# EAGLE design +X SOLAR PANEL (EAGLE 8.7.0)
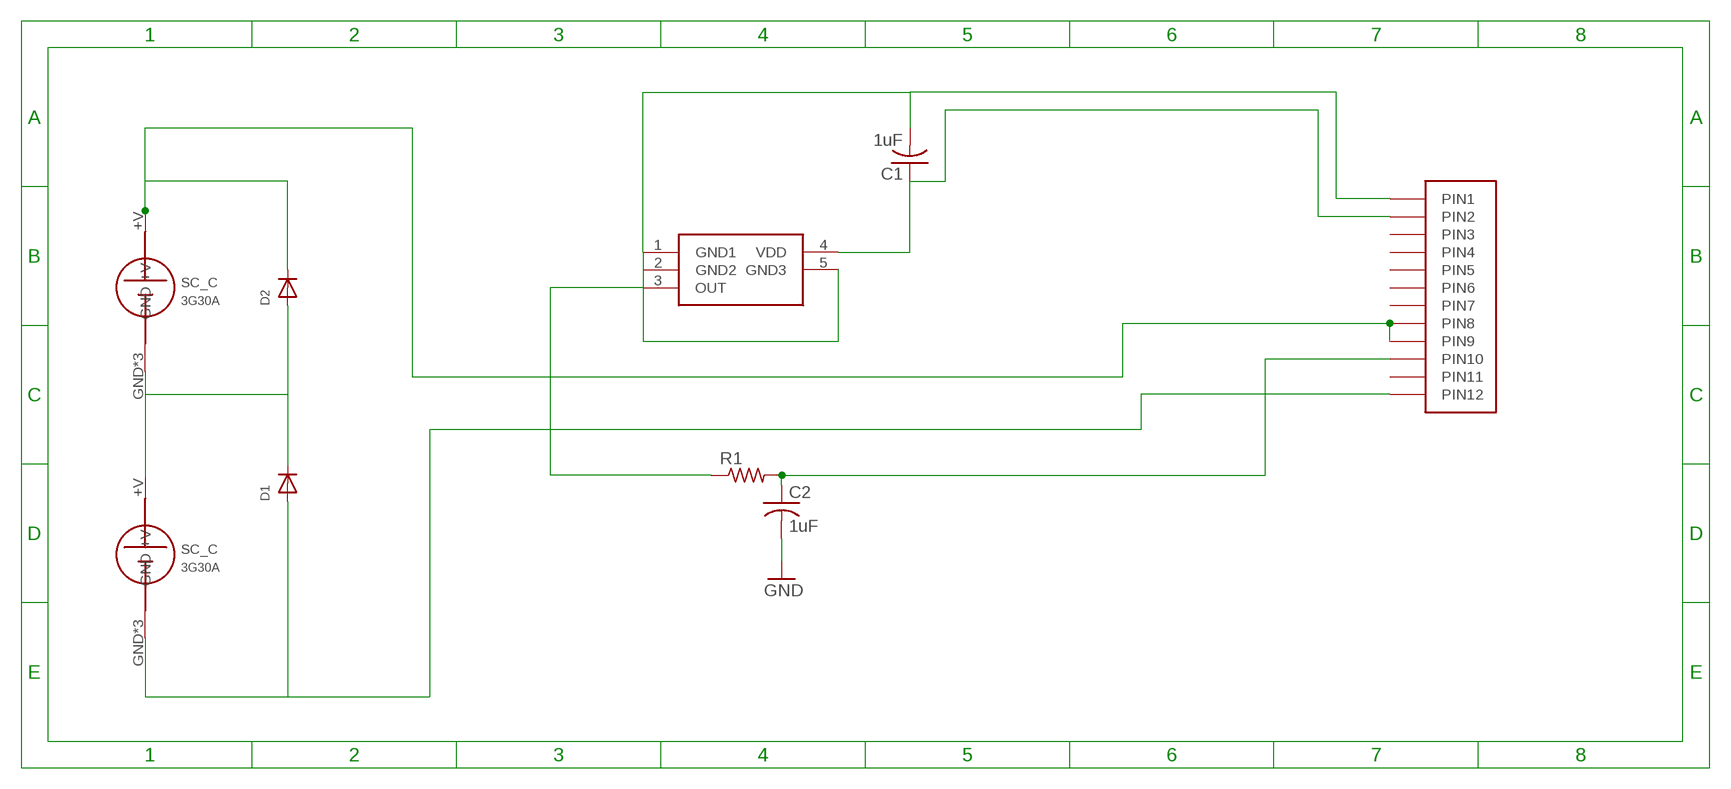
[diagram p0: schematic, sheet 1]

## Parts
C1  1uF  C-USC0805  [C0805]
C2  1uF  C-USC0805  [C0805]
D1  DIODE_SOD-123FL  [SOD-123FL]
D2  DIODE_SOD-123FL  [SOD-123FL]
R1  R-US_R0402  [R0402]
U$1  HEADER12PIN  [HEADER12PIN]
U$3  LMT84DCKT  [SOT65P210X110-5N]
U$4  SC_C  [SC_C]
U$5  SC_C  [SC_C]

## Nets
+V: D2.C U$1.P8(PIN8) U$1.P9(PIN9) U$4.+V
GND: C1.2 C2.2 D1.A U$1.P1(PIN1) U$1.P12(PIN12) U$3.1(GND1) U$3.2(GND2) U$3.5(GND3) U$5.GND U$5.GND1(GND) U$5.GND2(GND)
N$1: D1.C D2.A U$4.GND U$4.GND1(GND) U$4.GND2(GND) U$5.+V
N$2: R1.1 U$3.3(OUT)
N$3: C2.1 R1.2 U$1.P10(PIN10)
N$10: C1.1 U$1.P2(PIN2) U$3.4(VDD)
Unconnected: U$1.P3(PIN3) U$1.P4(PIN4) U$1.P5(PIN5) U$1.P6(PIN6) U$1.P7(PIN7) U$1.P11(PIN11)

## Library data of the parts
C1 C2 = adafruit:C-US: CAPACITOR, American symbol
D1 D2 = adafruit:DIODE: Diode SMADIODE - SMA Surface Mount Package 20V 1A Schottky Diode Digikey: 641-1014-6-ND DO-1N4148 - Through Hole Small Current Diode SOD-123 20V 1 A (.5mV Vf) Schottky Diode - Digikey: MBRX120TPMSCT-ND SOD-323 10V 570mA (.38mV Vf, 3ns) Schottky Diode - Digikey: ZLLS410CT-ND SOD-523 30V 30mA Schottky Diode (RB751S-40TE61) - Digikey: RB751S-40TE61CT-ND SOT23-R/W - SOT23 Package (R = Solder Paste/Reflow Ovens, W = Hand-Soldering) BAT54Film 40V 300mA - Digikey: 497-7162-1-ND
R1 = adafruit:R-US_: RESISTOR, American symbol
U$1 = BIRDS:HEADER12PIN
U$3 = LMT84DCKT:LMT84DCKT: 1.5V-Capable, 10 uA Analog Output Temperature Sensor in SC70 and TO-92 Source: Datasheet <http://uk.rs-online.com/web/p/products/8115860>; DESCRIPTION: 1.5V-Capable, 10 uA Analog Output Temperature Sensor in SC70 and TO-92; HEIGHT: 1.1mm; MANUFACTURER_NAME: Texas Instruments; MANUFACTURER_PART_NUMBER: LMT84DCKT; RS_PART_NUMBER: 8115860
U$4 U$5 = SC_C:SC_C

## Board
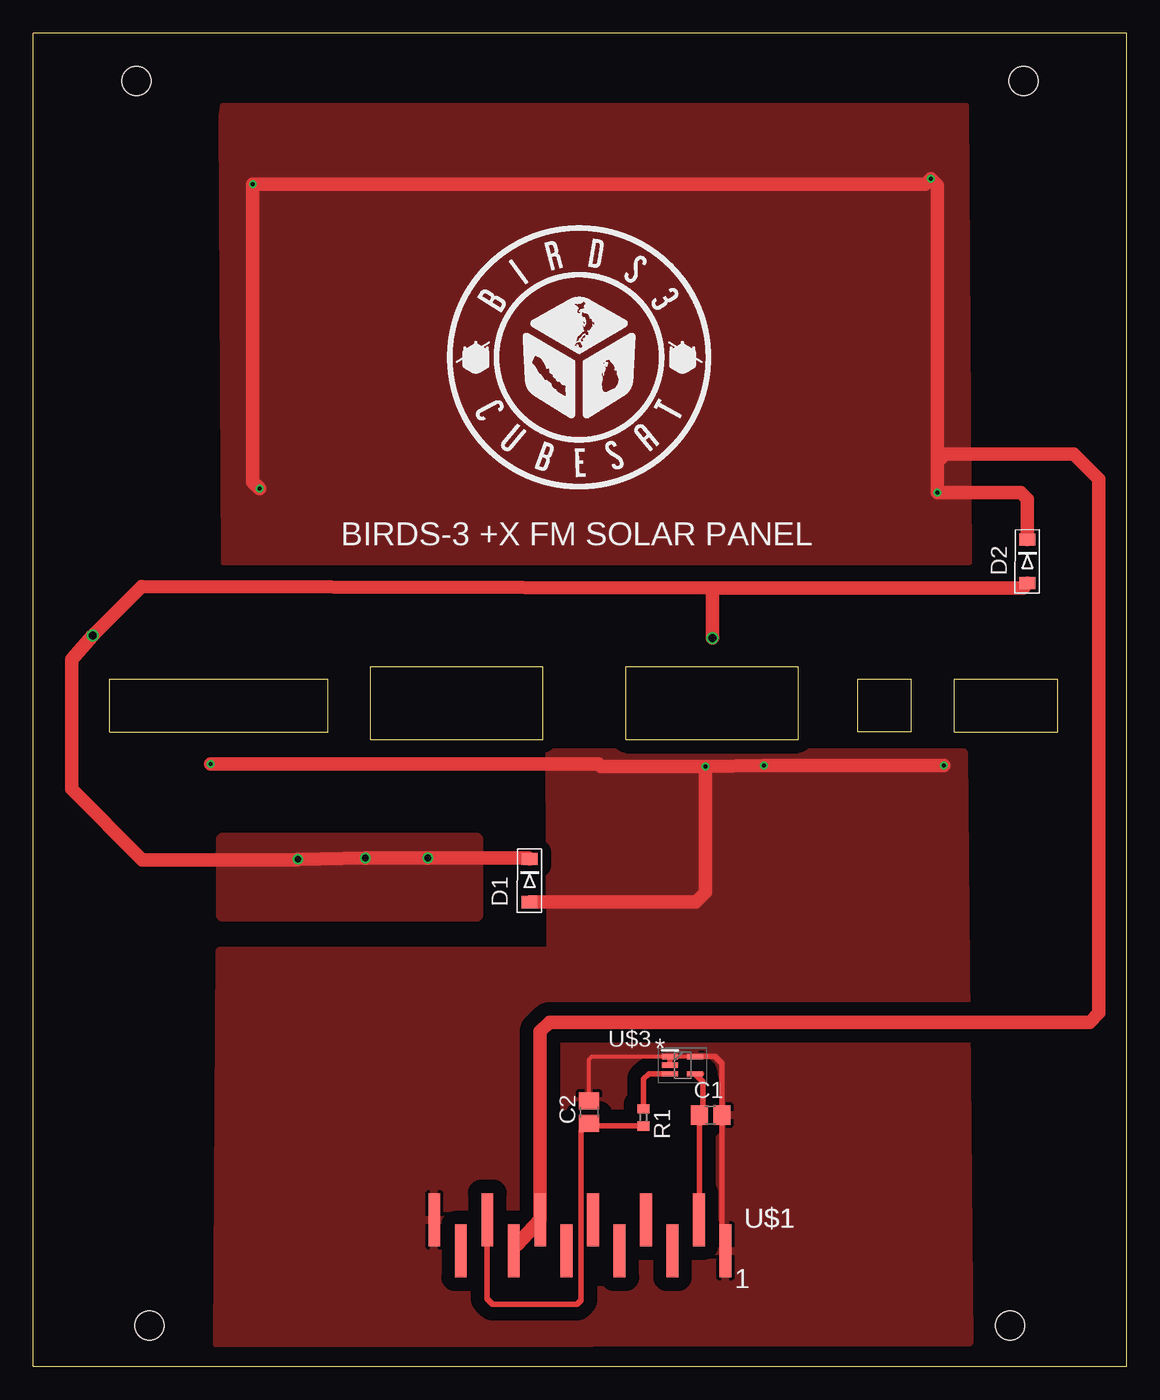
[diagram p1: board, top side]
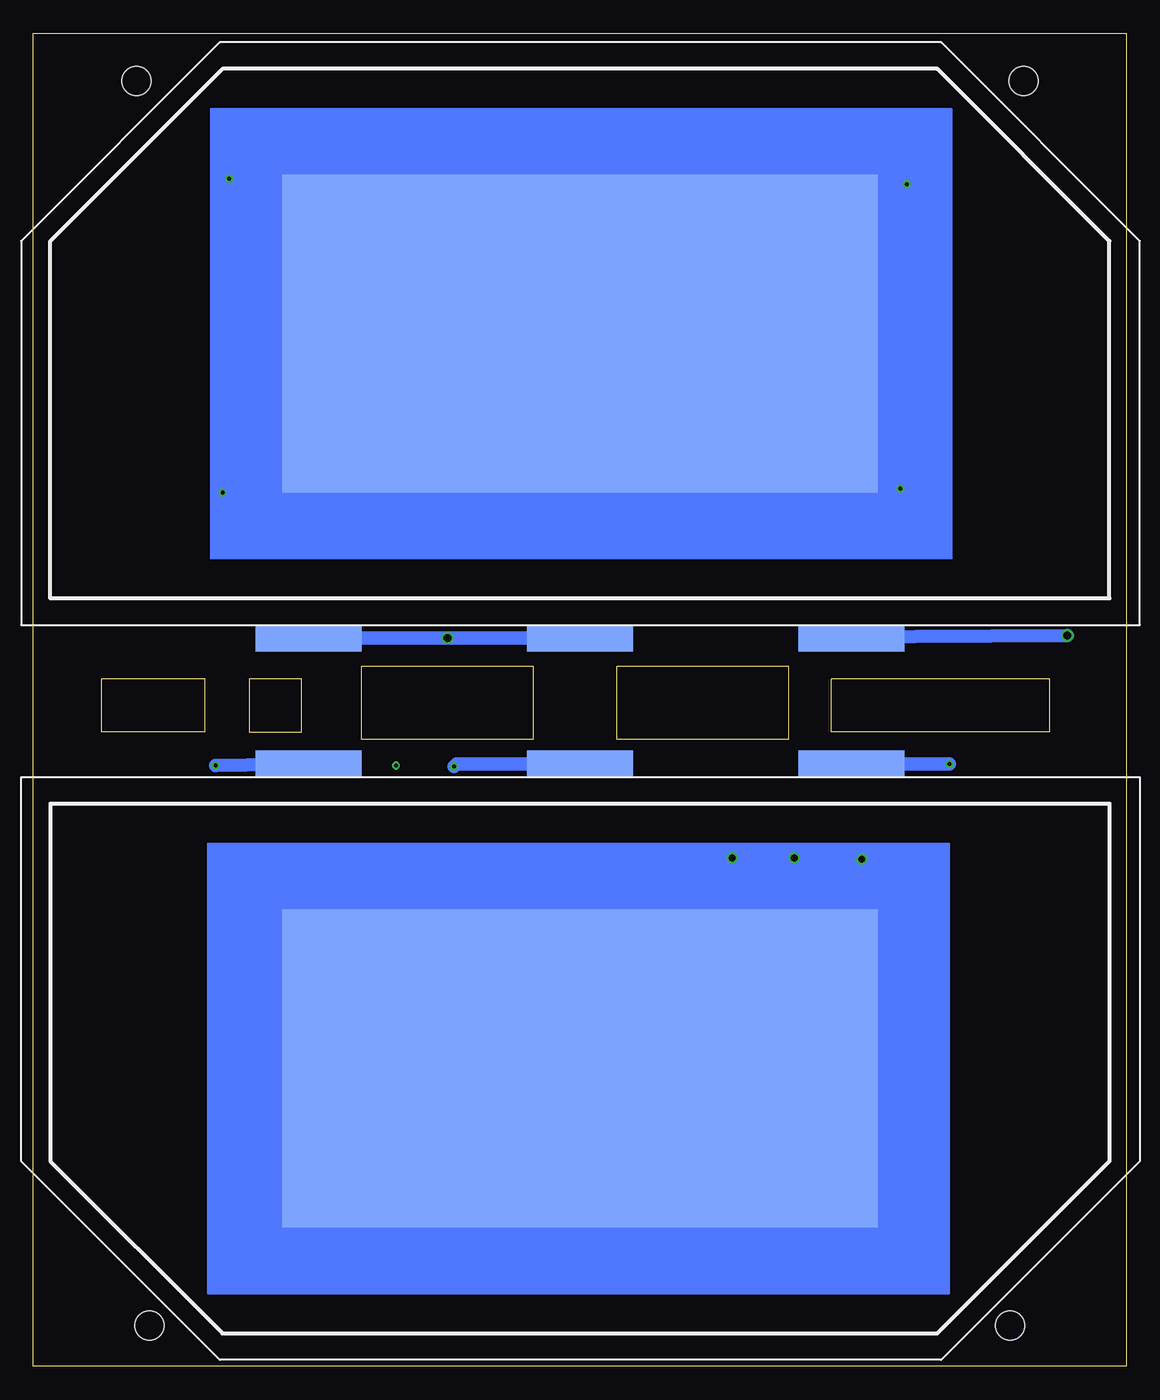
[diagram p2: board, bottom side, seen from below]

Size 82.6 x 100.7 mm. Coordinates in mm from the lower left corner, seen from the top.
Outline: 82.6,100.7 0,100.7 0,0 82.6,0 82.6,100.7
Outline: 69.6,47.9 77.4,47.9 77.4,51.9 69.6,51.9 69.6,47.9
Outline: 66.3,47.9 62.3,47.9 62.3,51.9 66.3,51.9 66.3,47.9
Outline: 44.8,47.35 57.8,47.35 57.8,52.85 44.8,52.85 44.8,47.35
Outline: 25.5,47.35 38.5,47.35 38.5,52.85 25.5,52.85 25.5,47.35
Outline: 5.8,47.9 22.3,47.9 22.3,51.9 5.8,51.9 5.8,47.9
Copper layers (1*16): Top 0.035mm / dielectric 1.53mm / Bottom 0.035mm
Design rules "pban_5mil-l2": minimum track width 5mil, minimum drill 0.3mm, track to track 5mil, track to pad 0.229mm, pad to pad 5mil, via to via 5mil, smd to smd 5mil, copper to edge 0.5mm, drill to drill 0.5mm, minimum pad ring 0.15mm, minimum via ring 0.15mm, stop-mask expansion 4mil, vias tented up to drill 0.35mm, thermal gap 10mil
Holes 2.2 mm at 74.8,97.1 7.8,97.1 73.8,3.1 8.8,3.1

### Footprints (pad centres in the part's own frame; a part is rotated, then mirrored left to right if it is on the bottom)
C0805 = smd 1.3 x 1.5: 1 -0.85,0; 2 0.85,0
SOD-123FL = smd 0.91 x 1.22 bottom: A 1.637,0; C -1.637,0
R0402 = smd 0.7 x 0.9: 1 -0.65,0; 2 0.65,0
HEADER12PIN = smd 4 x 0.89: P1 0,0; P2 2.35,2; P3 0,4; P4 2.35,6; P5 0,8; P6 2.35,10; P7 0,12; P8 2.35,14; P9 0,16; P10 2.35,18; P11 0,20; P12 2.35,22
SOT65P210X110-5N = smd 1.2 x 0.4: 1 -0.95,0.65; 2 -0.95,0; 3 -0.95,-0.65; 4 0.95,-0.65; 5 0.95,0.65
SC_C = smd 45 x 24 bottom: +V 40.1,20 | smd 8 x 2 bottom: GND 40.1,-3; GND1 19.6,-3; GND2 60.6,-3

### Placement (x,y rotation side)
C1  51.17,18.98 0 top
C2  42,19.2 90 top
D1  37.5,36.7 270 bottom
D2  75.1,60.8 270 bottom
R1  46.1,18.8 270 top
U$1  52.3,8.72 90 top
U$3  49.05,22.75 0 top
U$4  1.2,58 0 top
U$5  81.4,42.5 180 top

### Tracks (layer width: path | path; a pad name or v marks a point on that pad's centre or on a via)
+V  (via drill 0.3)
  Top 0.813: 36.5,9.15 U$1.P9
  Top 1.016: D2.C 75.1,65.5 74.6,66 v68.3,66 68.3,68.3 | 68.3,68.3 68.9,68.9 78.6,68.9 80.5,67 80.5,26.7 79.8,26 39,26 38.3,25.3 U$1.P8 36.5,9.15 | 68.3,68.3 68.3,89.2 v67.8,89.7 67.4,89.3 v16.6,89.3 16.6,66.8 v17.1,66.3
  Bottom 0.61: 42.76,78.6 U$4.+V
  Bottom 1.016: 42.76,78.6 42.76,89.7 v67.8,89.7
  pour Top: 14.3,95.2 70.5,95.2 70.7,60.7 14.4,60.7 14.2,94.4
GND  (via drill 0.3)
  Top 0.305: C2.2 42,23.2 42.2,23.4 U$3.1 U$3.5
  Top 0.406: U$3.2 U$3.1 | U$1.P1 52.02,9 C1.2 52.02,22.89 51.52,23.4 U$3.5
  Top 1.016: v50.8,45.3 v55.2,45.4 v68.8,45.4 | v50.8,45.3 42.9,45.3 42.7,45.5 v13.4,45.5 | D1.A 50.06,35.06 50.8,35.8 v50.8,45.3
  Bottom 0.406: 62.1,46 62.2,45.9 62.8,45.9 U$5.GND1
  Bottom 1.016: U$5.GND1 v68.8,45.4 | U$5.GND2 v13.4,45.5 | U$5.GND 50.6,45.5 v50.8,45.3
  pour Top (isolate 1.016): 39,46.4 70.3,46.4 70.7,1.8 13.9,1.7 14.1,31.4 39.1,31.4
N$1  (via drill 0.5, 0.6)
  Top 1.016: 51.5,58.8 8.2,58.9 v4.5,55.2 2.9,53.4 2.9,43.6 8.25,38.25 19.95,38.25 v20,38.3 v25.1,38.4 v29.8,38.4 37.44,38.4 D1.C | v51.3,55 51.3,58.6 51.5,58.8 | D2.A 74.74,58.8 51.5,58.8
  Bottom 1.016: U$5.+V 42.3,38.4 v29.8,38.4 | v4.5,55.2 21.7,55.1 U$4.GND1 | U$4.GND v51.3,55 U$4.GND2
  pour Top (isolate 1.016): 14.3,39.8 33.5,39.8 33.5,34.1 14.3,34.1 14.3,39.7
N$2
  Top 0.406: R1.1 46.1,21.7 46.5,22.1 U$3.3
N$3
  Top 0.406: R1.2 42.2,18.15 C2.1 41.4,17.75 41.4,5 41.1,4.7 34.7,4.7 34.3,5.1 U$1.P10
  Top 0.61: 42.05,18.3 C2.1
N$10
  Top 0.406: 50.5,22.1 U$3.4 50.6,21.5 50.6,19 | C1.1 50.33,11.1 U$1.P2
  Top 0.61: 50.5,18.89 C1.1 50.6,19 50.5,18.89

### Text on the board
tPlace: BIRDS-3 +X FM SOLAR PANEL
tNames: * | U$1 | U$1 | 1